# Altium project PCB_Project.PrjPcb
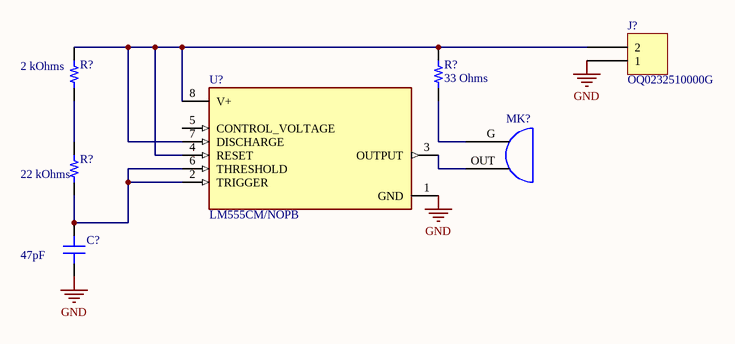
[diagram p0: Sheet1.SchDoc]
1 sheet, 7 parts. Net scope: global (net labels, ports and power ports of the same name join across sheets).
Board file: PCB1.PcbDoc

## Sheet Sheet1.SchDoc
size A4; SheetNumber: 1; SheetTotal: 1

### Parts
(Parts that share a designator on the sheet are numbered #1, #2 ... from top to bottom, then left to right.)
C?  47pF  [CAP 1206_3216 - 0.8MM]
J?  OQ0232510000G  [FCI 06-381-2PIN]
MK?  CMEJ-0415-42-P  [CUI CMEJ-0415-42-P]  (value not drawn)
R?#1  2 kOhms  [RES 1206_3216]
R?#2  33 Ohms  [RES 1206_3216]
R?#3  22 kOhms  [RES 1206_3216]
U?  LM555CM/NOPB  [SOIC127P599X175-8N]

### Nets
GND: C?.1 J?.1 U?.1(GND)
NetC?_2: C?.2 R?#3.1 U?.2(TRIGGER) U?.6(THRESHOLD)
NetJ?_2: J?.2 R?#1.2 R?#2.2 U?.4(RESET) U?.7(DISCHARGE) U?.8(V+)
NetMK?_G: MK?.G(GND) R?#2.1
NetMK?_OUT: MK?.OUT U?.3(OUTPUT)
NetR?#1_1: R?#1.1 R?#3.2

Not connected (* = marked no-connect by the designer): U? 5(CONTROL_VOLTAGE)

### Library data of the parts
C? = AC1206JRNPOBBN470: CAP CER 47PF 500V NPO 1206; Manufacturer: Yageo; Temperature Coefficient: C0G, NP0; Tolerance: ±5%; Part Number: AC1206JRNPOBBN470; Value: 47pF; Applications: Automotive; Capacitance: 47pF; ComponentLink1Description: Datasheet; ComponentLink1URL: http://www.yageo.com/NewPortal/_en/search/productDocs.jsp?YageoPartNumber=AC1206JRNPOBBN470; ComponentLink2Description: DigiKey Link; ComponentLink2URL: http://digikey.com/product-detail/en/yageo/AC1206JRNPOBBN470/311-3213-1-ND/6643465; Device Package: 1206 (3216 Metric); LastUpdated: 2.09.2020 01:04:46; Lifecycle Status: Active; Minimum Order: 1; Mounting Type: Surface Mount, MLCC; Operating Temperature: -55°C ~ 125°C; Package / Case: 1206 (3216 Metric); Packaging: TapeAndReel; PartId: 18705; Part Status: Active; Price: 0.10; Ratings: AEC-Q200; Series: AC; Size / Dimension: 0.126" L x 0.063" W (3.20mm x 1.60mm); Supplier 1: DigiKey; Supplier Part Number 1: 311-3213-1-ND; Thickness (Max): 0.028" (0.70mm); Voltage - Rated: 500V
J? = OQ0232510000G: TERM BLOCK HDR 2POS 90DEG 3.81MM; Manufacturer: Amphenol Anytek; Current - UL: 10A; Header Orientation: 90°, Right Angle; Number of Levels: 1; Number of Positions: 2; Pitch: 0.150" (3.81mm); Voltage - UL: 300V; Part Number: OQ0232510000G; Color: Green; ComponentLink1Description: Datasheet; ComponentLink1URL: http://portal.fciconnect.com/Comergent//fci/drawing/oqxx32x100j0g.pdf; ComponentLink2Description: DigiKey Link; ComponentLink2URL: //digikey.com/product-detail/en/amphenol-anytek/OQ0232510000G/609-3819-ND/2261255; Contact Mating Finish: Tin; LastUpdated: 16.12.2019 19:14:30; Lifecycle Status: 0; Minimum Order: 1; Mounting Type: Through Hole; Operating Temperature: -40°C ~ 115°C; Packaging: Bulk; Part Status: Active; Positions Per Level: 2; Price: 0.49; Series: 06-381; Supplier 1: DigiKey; Supplier Part Number 1: 609-3819-ND; Termination Style: Solder; Type: Header, Male Pins, Shrouded (4 Side)
MK? = CMEJ-0415-42-P: MICROPHONE, 4 MM, ELECTRET CONDE; Manufacturer: CUI Devices; Current - Supply: 500µA; Direction: Omnidirectional; Frequency Range: 100Hz ~ 10kHz; Output Type: Analog; Port Location: Top; Sensitivity: -42dB ±3dB @ 94dB SPL; Shape: Circular; S/N Ratio: 60dB; Voltage - Rated: 2V; Part Number: CMEJ-0415-42-P; ComponentLink1Description: Datasheet; ComponentLink1URL: https://www.cuidevices.com/product/resource/digikeypdf/cmej-0415-42-p.pdf; ComponentLink2Description: DigiKey Link; ComponentLink2URL: http://digikey.com/product-detail/en/cui-devices/CMEJ-0415-42-P/102-6542-ND/10253451; Height (Max): 0.067" (1.70mm); LastUpdated: 24.04.2020 00:49:53; Lifecycle Status: Active; Minimum Order: 1; Packaging: Tray; Part Status: Active; Price: 0.40; Series: CMEJ; Size / Dimension: 0.157" Dia (4.00mm); Supplier 1: DigiKey; Supplier Part Number 1: 102-6542-ND; Termination: PC Pins; Type: Electret Condenser
R?#1 = PTN1206E2001BST1: RES 2K OHM 0.1% 2/5W 1206; Manufacturer: Vishay Thin Film; Power (Watts): 0.4W, 2/5W; Temperature Coefficient: ±25ppm/°C; Part Number: PTN1206E2001BST1; ComponentLink1Description: Datasheet; ComponentLink1URL: http://www.vishay.com/docs/60026/ptn.pdf; ComponentLink2Description: DigiKey Link; ComponentLink2URL: http://digikey.com/product-detail/en/vishay-thin-film/PTN1206E2001BST1/764-1290-1-ND/7103074; Composition: Thin Film; Device Package: 1206 (3216 Metric); Features: Anti-Sulfur, Moisture Resistant, Non-Inductive; Height - Seated (Max): 0.033" (0.84mm); LastUpdated: 2.09.2020 01:13:11; Lifecycle Status: Active; Minimum Order: 1; Number of Terminations: 2; Operating Temperature: -55°C ~ 155°C; Package / Case: 1206 (3216 Metric); Packaging: TapeAndReel; PartId: 26935; Part Status: Active; Price: 0.27; Resistance: 2 kOhms; Series: PTN; Size / Dimension: 0.126" L x 0.063" W (3.20mm x 1.60mm); Supplier 1: DigiKey; Supplier Part Number 1: 764-1290-1-ND; Supplier Device Package: 1206; Tolerance: ±0.1%; Value: 2 kOhms
R?#2 = AC1206JR-0733RL: RES SMD 33 OHM 5% 1/4W 1206; Manufacturer: Yageo; Power (Watts): 0.25W, 1/4W; Temperature Coefficient: ±100ppm/°C; Part Number: AC1206JR-0733RL; ComponentLink1Description: Datasheet; ComponentLink1URL: https://www.yageo.com/upload/media/product/productsearch/datasheet/rchip/PYu-AC_51_RoHS_L_7.pdf; ComponentLink2Description: DigiKey Link; ComponentLink2URL: http://digikey.com/product-detail/en/yageo/AC1206JR-0733RL/YAG3955CT-ND/6006804; Composition: Thick Film; Device Package: 1206 (3216 Metric); Features: Automotive AEC-Q200, Moisture Resistant; Height - Seated (Max): 0.026" (0.65mm); LastUpdated: 2.09.2020 01:13:10; Lifecycle Status: Active; Minimum Order: 1; Number of Terminations: 2; Operating Temperature: -55°C ~ 155°C; Package / Case: 1206 (3216 Metric); Packaging: TapeAndReel; PartId: 27117; Part Status: Active; Price: 0.01; Ratings: AEC-Q200; Resistance: 33 Ohms; Series: AC; Size / Dimension: 0.122" L x 0.063" W (3.10mm x 1.60mm); Supplier 1: DigiKey; Supplier Part Number 1: YAG3955CT-ND; Supplier Device Package: 1206; Tolerance: ±5%; Value: 33 Ohms
R?#3 = RT1206BRD0722KL: RES SMD 22K OHM 0.1% 1/4W 1206; Manufacturer: Yageo; Power (Watts): 0.25W, 1/4W; Temperature Coefficient: ±25ppm/°C; Part Number: RT1206BRD0722KL; ComponentLink1Description: Datasheet; ComponentLink1URL: https://www.yageo.com/upload/media/product/productsearch/datasheet/rchip/PYu-RT_1-to-0.01_RoHS_L_11.pdf; ComponentLink2Description: DigiKey Link; ComponentLink2URL: http://digikey.com/product-detail/en/yageo/RT1206BRD0722KL/YAG2027CT-ND/5139475; Composition: Thin Film; Device Package: 1206 (3216 Metric); Height - Seated (Max): 0.026" (0.65mm); LastUpdated: 2.09.2020 01:13:11; Lifecycle Status: Active; Minimum Order: 1; Number of Terminations: 2; Operating Temperature: -55°C ~ 155°C; Package / Case: 1206 (3216 Metric); Packaging: TapeAndReel; PartId: 26867; Part Status: Active; Price: 0.10; Resistance: 22 kOhms; Series: RT; Size / Dimension: 0.122" L x 0.063" W (3.10mm x 1.60mm); Supplier 1: DigiKey; Supplier Part Number 1: YAG2027CT-ND; Supplier Device Package: 1206; Tolerance: ±0.1%; Value: 22 kOhms
U? = LM555CM/NOPB: Highly Stable 555 Timer 8-SOIC 0 to 70; MF: Texas Instruments; Package: SOIC-8 Texas Instruments; DigiKey-Purchase-URL: https://snapeda.com/shop?store=DigiKey&id=50124; Value: *; Mouser-Purchase-URL: https://snapeda.com/shop?store=Mouser&id=50124; Availability: Good; SnapEDA_Link: https://www.snapeda.com/parts/LM555CM/NOPB/Texas%20Instruments/view-part/50124/?ref=snap; MP: LM555CM/NOPB; Price: None; Arrow_Asia-Purchase-URL: https://snapeda.com/shop?store=Arrow+Asia&id=50124; Texas_Instruments-Purchase-URL: https://snapeda.com/shop?store=Texas+Instruments&id=50124; Check_prices: https://www.snapeda.com/parts/LM555CM/NOPB/Texas%20Instruments/view-part/50124/?ref=eda